# Altium schematic sheet 38.DRAM-LPDDR4X_200P_1X32bit.SchDoc (part 2 of 2)
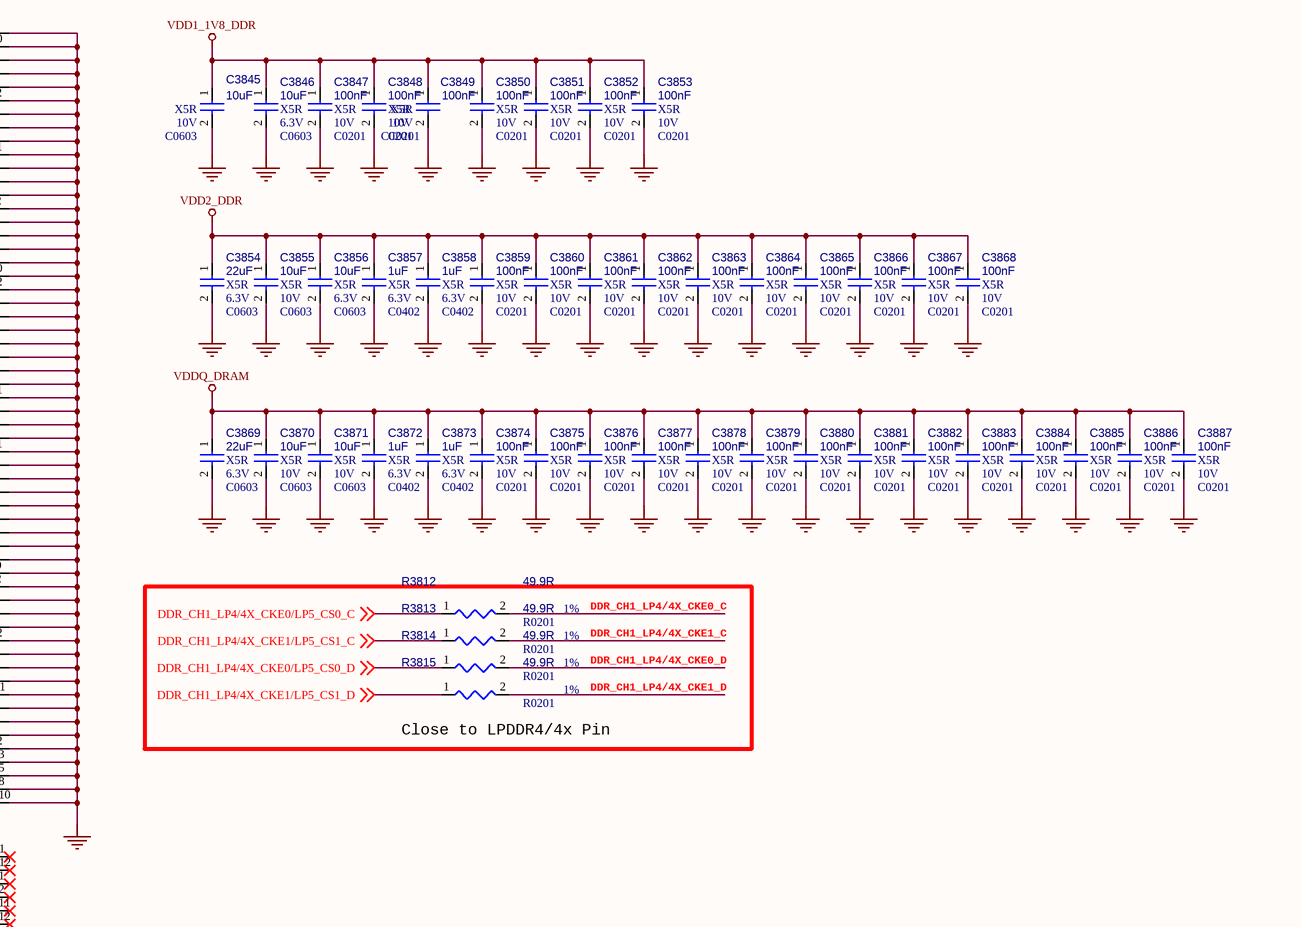
[diagram p4: 38.DRAM-LPDDR4X_200P_1X32bit.SchDoc, bottom right]

## Library data of the parts
C3800 = CAP NP: cap,10.00uF,+/-10%,10V,X5R,C0603; Part Reference: C3800; Manufacturer: TDK; Value: 10uF; Number: 37; RK PN: C1608X5R1A106K080AC; Priority: A; Tolerance: 10%; C_Voltage: 6.3V; PCB Footprint: C0603; Part Type: C0603; Manufacturer PN: C1608X5R1A106K080AC; Created by: JJJ
C3801 = CAP NP: cap,10.00uF,+/-10%,6.3V,X5R,C0603; Part Reference: C3801; Manufacturer: TDK; Value: 10uF; RK PN: C1608X5R0J106K080AB; Priority: A; Tolerance: 10%; PCB Footprint: C0603; Part Type: C0603; Manufacturer PN: C1608X5R0J106K080AB; Created by: JJJ
C3802 = CAP NP: cap,100.00nF,+/-10%,10V,X5R,C0201; Part Reference: C3802; Manufacturer PN: C0603X5R1A104K030BC; Manufacturer: TDK; Value: 100nF; Tolerance: 10%; Priority: A; PCB Footprint: C0201; Created by: JJJ; Part Type: C0201; RK PN: C0603X5R1A104K030BC
C3803 = CAP NP: cap,100.00nF,+/-10%,10V,X5R,C0201; Part Reference: C3803; Manufacturer: TDK; Value: 100nF; RK PN: C0603X5R1A104K030BC; Priority: A; Tolerance: 10%; PCB Footprint: C0201; Part Type: C0201; Manufacturer PN: C0603X5R1A104K030BC; Created by: JJJ
C3804 = CAP NP: cap,100.00nF,+/-10%,10V,X5R,C0201; Part Reference: C3804; Manufacturer PN: C0603X5R1A104K030BC; Manufacturer: TDK; Value: 100nF; C_Voltage: 6.3V; Tolerance: 10%; Priority: A; Number: 37; PCB Footprint: C0201; Created by: JJJ; Part Type: C0201; RK PN: C0603X5R1A104K030BC
C3805 = CAP NP: cap,100.00nF,+/-10%,10V,X5R,C0201; Part Reference: C3805; Manufacturer PN: C0603X5R1A104K030BC; Manufacturer: TDK; Value: 100nF; Tolerance: 10%; Priority: A; PCB Footprint: C0201; Created by: JJJ; Part Type: C0201; RK PN: C0603X5R1A104K030BC
C3806 = CAP NP: cap,100.00nF,+/-10%,10V,X5R,C0201; Part Reference: C3806; Manufacturer PN: C0603X5R1A104K030BC; Manufacturer: TDK; Value: 100nF; Tolerance: 10%; Priority: A; PCB Footprint: C0201; Created by: JJJ; Part Type: C0201; RK PN: C0603X5R1A104K030BC
C3807 = CAP NP: cap,100.00nF,+/-10%,10V,X5R,C0201; Part Reference: C3807; Manufacturer: TDK; Value: 100nF; RK PN: C0603X5R1A104K030BC; Priority: A; Tolerance: 10%; PCB Footprint: C0201; Part Type: C0201; Manufacturer PN: C0603X5R1A104K030BC; Created by: JJJ
C3808 = CAP NP: cap,100.00nF,+/-10%,10V,X5R,C0201; Part Reference: C3808; Manufacturer: TDK; Value: 100nF; RK PN: C0603X5R1A104K030BC; Priority: A; Tolerance: 10%; PCB Footprint: C0201; Part Type: C0201; Manufacturer PN: C0603X5R1A104K030BC; Created by: JJJ
C3809 = CAP NP: cap,22.00uF,+/-20%,6.3V,X5R,C0603; Part Reference: C3809; Manufacturer: TDK; Value: 22uF; RK PN: C1608X5R0J226M080AC; Priority: A; Tolerance: 20%; PCB Footprint: C0603; Part Type: C0603; C_Voltage: 6.3V; Manufacturer PN: C1608X5R0J226M080AC; Created by: JJJ
C3810 = CAP NP: cap,10.00uF,+/-10%,10V,X5R,C0603; Part Reference: C3810; Manufacturer: TDK; Value: 10uF; RK PN: C1608X5R1A106K080AC; Priority: A; C_Voltage: 6.3V; Tolerance: 10%; PCB Footprint: C0603; Part Type: C0603; Manufacturer PN: C1608X5R1A106K080AC; Created by: JJJ
C3811 = CAP NP: cap,10.00uF,+/-10%,6.3V,X5R,C0603; Part Reference: C3811; Manufacturer: TDK; Value: 10uF; RK PN: C1608X5R0J106K080AB; Priority: A; Tolerance: 10%; PCB Footprint: C0603; Part Type: C0603; Manufacturer PN: C1608X5R0J106K080AB; Created by: JJJ
C3812 = CAP NP: cap,1.00uF,+/-10%,6.3V,X5R,C0402; Part Reference: C3812; Manufacturer: TDK; Value: 1uF; RK PN: C1005X5R0J105K050BB; Priority: A; Tolerance: 10%; PCB Footprint: C0402; Part Type: C0402; Manufacturer PN: C1005X5R0J105K050BB; Created by: JJJ
C3813 = CAP NP: cap,1.00uF,+/-10%,6.3V,X5R,C0402; Part Reference: C3813; Manufacturer: TDK; Value: 1uF; RK PN: C1005X5R0J105K050BB; Priority: A; Tolerance: 10%; PCB Footprint: C0402; Part Type: C0402; Manufacturer PN: C1005X5R0J105K050BB; Created by: JJJ
C3814 = CAP NP: cap,100.00nF,+/-10%,10V,X5R,C0201; Part Reference: C3814; Manufacturer: TDK; Value: 100nF; RK PN: C0603X5R1A104K030BC; Priority: A; Tolerance: 10%; PCB Footprint: C0201; Part Type: C0201; Manufacturer PN: C0603X5R1A104K030BC; Created by: JJJ
C3815 = CAP NP: cap,100.00nF,+/-10%,10V,X5R,C0201; Part Reference: C3815; Manufacturer: TDK; Value: 100nF; RK PN: C0603X5R1A104K030BC; Priority: A; Tolerance: 10%; PCB Footprint: C0201; Part Type: C0201; Manufacturer PN: C0603X5R1A104K030BC; Created by: JJJ
C3816 = CAP NP: cap,100.00nF,+/-10%,10V,X5R,C0201; Part Reference: C3816; Manufacturer PN: C0603X5R1A104K030BC; Manufacturer: TDK; Value: 100nF; Tolerance: 10%; Priority: A; PCB Footprint: C0201; Created by: JJJ; Part Type: C0201; RK PN: C0603X5R1A104K030BC
C3817 = CAP NP: cap,100.00nF,+/-10%,10V,X5R,C0201; Part Reference: C3817; Manufacturer: TDK; Value: 100nF; RK PN: C0603X5R1A104K030BC; Priority: A; Tolerance: 10%; PCB Footprint: C0201; Part Type: C0201; Manufacturer PN: C0603X5R1A104K030BC; Created by: JJJ
C3818 = CAP NP: cap,100.00nF,+/-10%,10V,X5R,C0201; Part Reference: C3818; Manufacturer: TDK; Value: 100nF; RK PN: C0603X5R1A104K030BC; Priority: A; Tolerance: 10%; PCB Footprint: C0201; Part Type: C0201; Manufacturer PN: C0603X5R1A104K030BC; Created by: JJJ
C3819 = CAP NP: cap,100.00nF,+/-10%,10V,X5R,C0201; Part Reference: C3819; Manufacturer PN: C0603X5R1A104K030BC; Manufacturer: TDK; Value: 100nF; Tolerance: 10%; Priority: A; PCB Footprint: C0201; Created by: JJJ; Part Type: C0201; RK PN: C0603X5R1A104K030BC
C3820 = CAP NP: cap,100.00nF,+/-10%,10V,X5R,C0201; Part Reference: C3820; Manufacturer PN: C0603X5R1A104K030BC; Manufacturer: TDK; Value: 100nF; Tolerance: 10%; Priority: A; PCB Footprint: C0201; Created by: JJJ; Part Type: C0201; RK PN: C0603X5R1A104K030BC
C3821 = CAP NP: cap,100.00nF,+/-10%,10V,X5R,C0201; Part Reference: C3821; Manufacturer: TDK; Value: 100nF; RK PN: C0603X5R1A104K030BC; Priority: A; Tolerance: 10%; PCB Footprint: C0201; Part Type: C0201; Manufacturer PN: C0603X5R1A104K030BC; Created by: JJJ
C3822 = CAP NP: cap,100.00nF,+/-10%,10V,X5R,C0201; Part Reference: C3822; Manufacturer PN: C0603X5R1A104K030BC; Manufacturer: TDK; Value: 100nF; Tolerance: 10%; Priority: A; PCB Footprint: C0201; Created by: JJJ; Part Type: C0201; RK PN: C0603X5R1A104K030BC
C3823 = CAP NP: cap,100.00nF,+/-10%,10V,X5R,C0201; Part Reference: C3823; Manufacturer: TDK; Value: 100nF; RK PN: C0603X5R1A104K030BC; Priority: A; Tolerance: 10%; PCB Footprint: C0201; Part Type: C0201; Manufacturer PN: C0603X5R1A104K030BC; Created by: JJJ
C3824 = CAP NP: cap,22.00uF,+/-20%,6.3V,X5R,C0603; Part Reference: C3824; Manufacturer PN: C1608X5R0J226M080AC; Manufacturer: TDK; Value: 22uF; Tolerance: 20%; Priority: A; PCB Footprint: C0603; Created by: JJJ; C_Voltage: 6.3V; Part Type: C0603; RK PN: C1608X5R0J226M080AC
C3825 = CAP NP: cap,10.00uF,+/-10%,10V,X5R,C0603; Part Reference: C3825; Manufacturer: TDK; Value: 10uF; RK PN: C1608X5R1A106K080AC; Priority: A; C_Voltage: 6.3V; Tolerance: 10%; PCB Footprint: C0603; Part Type: C0603; Manufacturer PN: C1608X5R1A106K080AC; Created by: JJJ
C3826 = CAP NP: cap,10.00uF,+/-10%,10V,X5R,C0603; Part Reference: C3826; Manufacturer PN: C1608X5R1A106K080AC; Manufacturer: TDK; Value: 10uF; Tolerance: 10%; C_Voltage: 6.3V; Priority: A; PCB Footprint: C0603; Created by: JJJ; Part Type: C0603; RK PN: C1608X5R1A106K080AC
C3827 = CAP NP: cap,1.00uF,+/-10%,6.3V,X5R,C0402; Part Reference: C3827; Manufacturer PN: C1005X5R0J105K050BB; Manufacturer: TDK; Value: 1uF; Tolerance: 10%; Priority: A; PCB Footprint: C0402; Created by: JJJ; Part Type: C0402; RK PN: C1005X5R0J105K050BB
C3828 = CAP NP: cap,1.00uF,+/-10%,6.3V,X5R,C0402; Part Reference: C3828; Manufacturer PN: C1005X5R0J105K050BB; Manufacturer: TDK; Value: 1uF; Tolerance: 10%; Priority: A; PCB Footprint: C0402; Created by: JJJ; Part Type: C0402; RK PN: C1005X5R0J105K050BB
C3829 = CAP NP: cap,100.00nF,+/-10%,10V,X5R,C0201; Part Reference: C3829; Manufacturer PN: C0603X5R1A104K030BC; Manufacturer: TDK; Value: 100nF; Tolerance: 10%; Priority: A; PCB Footprint: C0201; Created by: JJJ; Part Type: C0201; RK PN: C0603X5R1A104K030BC
C3830 = CAP NP: cap,100.00nF,+/-10%,10V,X5R,C0201; Part Reference: C3830; Manufacturer PN: C0603X5R1A104K030BC; Manufacturer: TDK; Value: 100nF; Tolerance: 10%; Priority: A; PCB Footprint: C0201; Created by: JJJ; Part Type: C0201; RK PN: C0603X5R1A104K030BC
C3831 = CAP NP: cap,100.00nF,+/-10%,10V,X5R,C0201; Part Reference: C3831; Manufacturer PN: C0603X5R1A104K030BC; Manufacturer: TDK; Value: 100nF; Tolerance: 10%; Priority: A; PCB Footprint: C0201; Created by: JJJ; Part Type: C0201; RK PN: C0603X5R1A104K030BC
C3832 = CAP NP: cap,100.00nF,+/-10%,10V,X5R,C0201; Part Reference: C3832; Manufacturer: TDK; Value: 100nF; RK PN: C0603X5R1A104K030BC; Priority: A; Tolerance: 10%; PCB Footprint: C0201; Part Type: C0201; Manufacturer PN: C0603X5R1A104K030BC; Created by: JJJ
C3833 = CAP NP: cap,100.00nF,+/-10%,10V,X5R,C0201; Part Reference: C3833; Manufacturer: TDK; Value: 100nF; RK PN: C0603X5R1A104K030BC; Priority: A; Tolerance: 10%; PCB Footprint: C0201; Part Type: C0201; Manufacturer PN: C0603X5R1A104K030BC; Created by: JJJ
C3834 = CAP NP: cap,100.00nF,+/-10%,10V,X5R,C0201; Part Reference: C3834; Manufacturer: TDK; Value: 100nF; RK PN: C0603X5R1A104K030BC; Priority: A; Tolerance: 10%; PCB Footprint: C0201; Part Type: C0201; Manufacturer PN: C0603X5R1A104K030BC; Created by: JJJ
C3835 = CAP NP: cap,100.00nF,+/-10%,10V,X5R,C0201; Part Reference: C3835; Manufacturer PN: C0603X5R1A104K030BC; Manufacturer: TDK; Value: 100nF; Tolerance: 10%; Priority: A; PCB Footprint: C0201; Created by: JJJ; Part Type: C0201; RK PN: C0603X5R1A104K030BC
C3836 = CAP NP: cap,100.00nF,+/-10%,10V,X5R,C0201; Part Reference: C3836; Manufacturer: TDK; Value: 100nF; RK PN: C0603X5R1A104K030BC; Priority: A; Tolerance: 10%; PCB Footprint: C0201; Part Type: C0201; Manufacturer PN: C0603X5R1A104K030BC; Created by: JJJ
C3837 = CAP NP: cap,100.00nF,+/-10%,10V,X5R,C0201; Part Reference: C3837; Manufacturer: TDK; Value: 100nF; RK PN: C0603X5R1A104K030BC; Priority: A; Tolerance: 10%; PCB Footprint: C0201; Part Type: C0201; Manufacturer PN: C0603X5R1A104K030BC; Created by: JJJ
C3838 = CAP NP: cap,100.00nF,+/-10%,10V,X5R,C0201; Part Reference: C3838; Manufacturer PN: C0603X5R1A104K030BC; Manufacturer: TDK; Value: 100nF; Tolerance: 10%; Priority: A; PCB Footprint: C0201; Created by: JJJ; Part Type: C0201; RK PN: C0603X5R1A104K030BC
C3839 = CAP NP: cap,100.00nF,+/-10%,10V,X5R,C0201; Part Reference: C3839; Manufacturer: TDK; Value: 100nF; RK PN: C0603X5R1A104K030BC; Priority: A; Tolerance: 10%; PCB Footprint: C0201; Part Type: C0201; Manufacturer PN: C0603X5R1A104K030BC; Created by: JJJ
C3840 = CAP NP: cap,100.00nF,+/-10%,10V,X5R,C0201; Part Reference: C3840; Manufacturer PN: C0603X5R1A104K030BC; Manufacturer: TDK; Value: 100nF; Tolerance: 10%; Priority: A; PCB Footprint: C0201; Created by: JJJ; Part Type: C0201; RK PN: C0603X5R1A104K030BC
C3841 = CAP NP: cap,100.00nF,+/-10%,10V,X5R,C0201; Part Reference: C3841; Manufacturer PN: C0603X5R1A104K030BC; Manufacturer: TDK; Value: 100nF; Tolerance: 10%; Priority: A; PCB Footprint: C0201; Created by: JJJ; Part Type: C0201; RK PN: C0603X5R1A104K030BC
C3842 = CAP NP: cap,100.00nF,+/-10%,10V,X5R,C0201; Part Reference: C3842; Manufacturer PN: C0603X5R1A104K030BC; Manufacturer: TDK; Value: 100nF; Tolerance: 10%; Priority: A; PCB Footprint: C0201; Created by: JJJ; Part Type: C0201; RK PN: C0603X5R1A104K030BC
C3843 = CAP NP: cap,10.00uF,+/-10%,10V,X5R,C0603; Part Reference: C3843; Manufacturer PN: C1608X5R1A106K080AC; Manufacturer: TDK; Value: 10uF; C_Voltage: 6.3V; Tolerance: 10%; Priority: A; Number: 37; PCB Footprint: C0603; Created by: JJJ; Part Type: C0603; RK PN: C1608X5R1A106K080AC
C3844 = CAP NP: cap,1.00nF,+/-10%,25V,X5R,C0201; Part Reference: C3844; Manufacturer PN: C0603X5R1E102K030BA; Manufacturer: TDK; Value: 1nF; Tolerance: 10%; Priority: A; PCB Footprint: C0201; Created by: JJJ; Part Type: C0201; RK PN: C0603X5R1E102K030BA
C3845 = CAP NP: cap,10.00uF,+/-10%,10V,X5R,C0603; Part Reference: C3845; Manufacturer: TDK; Value: 10uF; Number: 37; RK PN: C1608X5R1A106K080AC; Priority: A; Tolerance: 10%; C_Voltage: 6.3V; PCB Footprint: C0603; Part Type: C0603; Manufacturer PN: C1608X5R1A106K080AC; Created by: JJJ
C3846 = CAP NP: cap,10.00uF,+/-10%,6.3V,X5R,C0603; Part Reference: C3846; Manufacturer: TDK; Value: 10uF; RK PN: C1608X5R0J106K080AB; Priority: A; Tolerance: 10%; PCB Footprint: C0603; Part Type: C0603; Manufacturer PN: C1608X5R0J106K080AB; Created by: JJJ
C3847 = CAP NP: cap,100.00nF,+/-10%,10V,X5R,C0201; Part Reference: C3847; Manufacturer PN: C0603X5R1A104K030BC; Manufacturer: TDK; Value: 100nF; Tolerance: 10%; Priority: A; PCB Footprint: C0201; Created by: JJJ; Part Type: C0201; RK PN: C0603X5R1A104K030BC
C3848 = CAP NP: cap,100.00nF,+/-10%,10V,X5R,C0201; Part Reference: C3848; Manufacturer: TDK; Value: 100nF; RK PN: C0603X5R1A104K030BC; Priority: A; Tolerance: 10%; PCB Footprint: C0201; Part Type: C0201; Manufacturer PN: C0603X5R1A104K030BC; Created by: JJJ
C3849 = CAP NP: cap,100.00nF,+/-10%,10V,X5R,C0201; Part Reference: C3849; Manufacturer PN: C0603X5R1A104K030BC; Manufacturer: TDK; Value: 100nF; C_Voltage: 6.3V; Tolerance: 10%; Priority: A; Number: 37; PCB Footprint: C0201; Created by: JJJ; Part Type: C0201; RK PN: C0603X5R1A104K030BC
C3850 = CAP NP: cap,100.00nF,+/-10%,10V,X5R,C0201; Part Reference: C3850; Manufacturer PN: C0603X5R1A104K030BC; Manufacturer: TDK; Value: 100nF; Tolerance: 10%; Priority: A; PCB Footprint: C0201; Created by: JJJ; Part Type: C0201; RK PN: C0603X5R1A104K030BC
C3851 = CAP NP: cap,100.00nF,+/-10%,10V,X5R,C0201; Part Reference: C3851; Manufacturer PN: C0603X5R1A104K030BC; Manufacturer: TDK; Value: 100nF; Tolerance: 10%; Priority: A; PCB Footprint: C0201; Created by: JJJ; Part Type: C0201; RK PN: C0603X5R1A104K030BC
C3852 = CAP NP: cap,100.00nF,+/-10%,10V,X5R,C0201; Part Reference: C3852; Manufacturer: TDK; Value: 100nF; RK PN: C0603X5R1A104K030BC; Priority: A; Tolerance: 10%; PCB Footprint: C0201; Part Type: C0201; Manufacturer PN: C0603X5R1A104K030BC; Created by: JJJ
C3853 = CAP NP: cap,100.00nF,+/-10%,10V,X5R,C0201; Part Reference: C3853; Manufacturer: TDK; Value: 100nF; RK PN: C0603X5R1A104K030BC; Priority: A; Tolerance: 10%; PCB Footprint: C0201; Part Type: C0201; Manufacturer PN: C0603X5R1A104K030BC; Created by: JJJ
C3854 = CAP NP: cap,22.00uF,+/-20%,6.3V,X5R,C0603; Part Reference: C3854; Manufacturer: TDK; Value: 22uF; RK PN: C1608X5R0J226M080AC; Priority: A; Tolerance: 20%; PCB Footprint: C0603; Part Type: C0603; C_Voltage: 6.3V; Manufacturer PN: C1608X5R0J226M080AC; Created by: JJJ
C3855 = CAP NP: cap,10.00uF,+/-10%,10V,X5R,C0603; Part Reference: C3855; Manufacturer: TDK; Value: 10uF; RK PN: C1608X5R1A106K080AC; Priority: A; C_Voltage: 6.3V; Tolerance: 10%; PCB Footprint: C0603; Part Type: C0603; Manufacturer PN: C1608X5R1A106K080AC; Created by: JJJ
C3856 = CAP NP: cap,10.00uF,+/-10%,6.3V,X5R,C0603; Part Reference: C3856; Manufacturer: TDK; Value: 10uF; RK PN: C1608X5R0J106K080AB; Priority: A; Tolerance: 10%; PCB Footprint: C0603; Part Type: C0603; Manufacturer PN: C1608X5R0J106K080AB; Created by: JJJ
C3857 = CAP NP: cap,1.00uF,+/-10%,6.3V,X5R,C0402; Part Reference: C3857; Manufacturer: TDK; Value: 1uF; RK PN: C1005X5R0J105K050BB; Priority: A; Tolerance: 10%; PCB Footprint: C0402; Part Type: C0402; Manufacturer PN: C1005X5R0J105K050BB; Created by: JJJ
C3858 = CAP NP: cap,1.00uF,+/-10%,6.3V,X5R,C0402; Part Reference: C3858; Manufacturer: TDK; Value: 1uF; RK PN: C1005X5R0J105K050BB; Priority: A; Tolerance: 10%; PCB Footprint: C0402; Part Type: C0402; Manufacturer PN: C1005X5R0J105K050BB; Created by: JJJ
C3859 = CAP NP: cap,100.00nF,+/-10%,10V,X5R,C0201; Part Reference: C3859; Manufacturer: TDK; Value: 100nF; RK PN: C0603X5R1A104K030BC; Priority: A; Tolerance: 10%; PCB Footprint: C0201; Part Type: C0201; Manufacturer PN: C0603X5R1A104K030BC; Created by: JJJ
C3860 = CAP NP: cap,100.00nF,+/-10%,10V,X5R,C0201; Part Reference: C3860; Manufacturer: TDK; Value: 100nF; RK PN: C0603X5R1A104K030BC; Priority: A; Tolerance: 10%; PCB Footprint: C0201; Part Type: C0201; Manufacturer PN: C0603X5R1A104K030BC; Created by: JJJ
C3861 = CAP NP: cap,100.00nF,+/-10%,10V,X5R,C0201; Part Reference: C3861; Manufacturer PN: C0603X5R1A104K030BC; Manufacturer: TDK; Value: 100nF; Tolerance: 10%; Priority: A; PCB Footprint: C0201; Created by: JJJ; Part Type: C0201; RK PN: C0603X5R1A104K030BC
C3862 = CAP NP: cap,100.00nF,+/-10%,10V,X5R,C0201; Part Reference: C3862; Manufacturer: TDK; Value: 100nF; RK PN: C0603X5R1A104K030BC; Priority: A; Tolerance: 10%; PCB Footprint: C0201; Part Type: C0201; Manufacturer PN: C0603X5R1A104K030BC; Created by: JJJ
C3863 = CAP NP: cap,100.00nF,+/-10%,10V,X5R,C0201; Part Reference: C3863; Manufacturer: TDK; Value: 100nF; RK PN: C0603X5R1A104K030BC; Priority: A; Tolerance: 10%; PCB Footprint: C0201; Part Type: C0201; Manufacturer PN: C0603X5R1A104K030BC; Created by: JJJ
C3864 = CAP NP: cap,100.00nF,+/-10%,10V,X5R,C0201; Part Reference: C3864; Manufacturer PN: C0603X5R1A104K030BC; Manufacturer: TDK; Value: 100nF; Tolerance: 10%; Priority: A; PCB Footprint: C0201; Created by: JJJ; Part Type: C0201; RK PN: C0603X5R1A104K030BC
C3865 = CAP NP: cap,100.00nF,+/-10%,10V,X5R,C0201; Part Reference: C3865; Manufacturer PN: C0603X5R1A104K030BC; Manufacturer: TDK; Value: 100nF; Tolerance: 10%; Priority: A; PCB Footprint: C0201; Created by: JJJ; Part Type: C0201; RK PN: C0603X5R1A104K030BC
C3866 = CAP NP: cap,100.00nF,+/-10%,10V,X5R,C0201; Part Reference: C3866; Manufacturer: TDK; Value: 100nF; RK PN: C0603X5R1A104K030BC; Priority: A; Tolerance: 10%; PCB Footprint: C0201; Part Type: C0201; Manufacturer PN: C0603X5R1A104K030BC; Created by: JJJ
C3867 = CAP NP: cap,100.00nF,+/-10%,10V,X5R,C0201; Part Reference: C3867; Manufacturer PN: C0603X5R1A104K030BC; Manufacturer: TDK; Value: 100nF; Tolerance: 10%; Priority: A; PCB Footprint: C0201; Created by: JJJ; Part Type: C0201; RK PN: C0603X5R1A104K030BC
C3868 = CAP NP: cap,100.00nF,+/-10%,10V,X5R,C0201; Part Reference: C3868; Manufacturer: TDK; Value: 100nF; RK PN: C0603X5R1A104K030BC; Priority: A; Tolerance: 10%; PCB Footprint: C0201; Part Type: C0201; Manufacturer PN: C0603X5R1A104K030BC; Created by: JJJ
C3869 = CAP NP: cap,22.00uF,+/-20%,6.3V,X5R,C0603; Part Reference: C3869; Manufacturer PN: C1608X5R0J226M080AC; Manufacturer: TDK; Value: 22uF; Tolerance: 20%; Priority: A; PCB Footprint: C0603; Created by: JJJ; C_Voltage: 6.3V; Part Type: C0603; RK PN: C1608X5R0J226M080AC
C3870 = CAP NP: cap,10.00uF,+/-10%,10V,X5R,C0603; Part Reference: C3870; Manufacturer: TDK; Value: 10uF; RK PN: C1608X5R1A106K080AC; Priority: A; C_Voltage: 6.3V; Tolerance: 10%; PCB Footprint: C0603; Part Type: C0603; Manufacturer PN: C1608X5R1A106K080AC; Created by: JJJ
C3871 = CAP NP: cap,10.00uF,+/-10%,10V,X5R,C0603; Part Reference: C3871; Manufacturer PN: C1608X5R1A106K080AC; Manufacturer: TDK; Value: 10uF; Tolerance: 10%; C_Voltage: 6.3V; Priority: A; PCB Footprint: C0603; Created by: JJJ; Part Type: C0603; RK PN: C1608X5R1A106K080AC
C3872 = CAP NP: cap,1.00uF,+/-10%,6.3V,X5R,C0402; Part Reference: C3872; Manufacturer PN: C1005X5R0J105K050BB; Manufacturer: TDK; Value: 1uF; Tolerance: 10%; Priority: A; PCB Footprint: C0402; Created by: JJJ; Part Type: C0402; RK PN: C1005X5R0J105K050BB
C3873 = CAP NP: cap,1.00uF,+/-10%,6.3V,X5R,C0402; Part Reference: C3873; Manufacturer PN: C1005X5R0J105K050BB; Manufacturer: TDK; Value: 1uF; Tolerance: 10%; Priority: A; PCB Footprint: C0402; Created by: JJJ; Part Type: C0402; RK PN: C1005X5R0J105K050BB
C3874 = CAP NP: cap,100.00nF,+/-10%,10V,X5R,C0201; Part Reference: C3874; Manufacturer PN: C0603X5R1A104K030BC; Manufacturer: TDK; Value: 100nF; Tolerance: 10%; Priority: A; PCB Footprint: C0201; Created by: JJJ; Part Type: C0201; RK PN: C0603X5R1A104K030BC
C3875 = CAP NP: cap,100.00nF,+/-10%,10V,X5R,C0201; Part Reference: C3875; Manufacturer PN: C0603X5R1A104K030BC; Manufacturer: TDK; Value: 100nF; Tolerance: 10%; Priority: A; PCB Footprint: C0201; Created by: JJJ; Part Type: C0201; RK PN: C0603X5R1A104K030BC
C3876 = CAP NP: cap,100.00nF,+/-10%,10V,X5R,C0201; Part Reference: C3876; Manufacturer PN: C0603X5R1A104K030BC; Manufacturer: TDK; Value: 100nF; Tolerance: 10%; Priority: A; PCB Footprint: C0201; Created by: JJJ; Part Type: C0201; RK PN: C0603X5R1A104K030BC
C3877 = CAP NP: cap,100.00nF,+/-10%,10V,X5R,C0201; Part Reference: C3877; Manufacturer: TDK; Value: 100nF; RK PN: C0603X5R1A104K030BC; Priority: A; Tolerance: 10%; PCB Footprint: C0201; Part Type: C0201; Manufacturer PN: C0603X5R1A104K030BC; Created by: JJJ
C3878 = CAP NP: cap,100.00nF,+/-10%,10V,X5R,C0201; Part Reference: C3878; Manufacturer: TDK; Value: 100nF; RK PN: C0603X5R1A104K030BC; Priority: A; Tolerance: 10%; PCB Footprint: C0201; Part Type: C0201; Manufacturer PN: C0603X5R1A104K030BC; Created by: JJJ
C3879 = CAP NP: cap,100.00nF,+/-10%,10V,X5R,C0201; Part Reference: C3879; Manufacturer: TDK; Value: 100nF; RK PN: C0603X5R1A104K030BC; Priority: A; Tolerance: 10%; PCB Footprint: C0201; Part Type: C0201; Manufacturer PN: C0603X5R1A104K030BC; Created by: JJJ
C3880 = CAP NP: cap,100.00nF,+/-10%,10V,X5R,C0201; Part Reference: C3880; Manufacturer PN: C0603X5R1A104K030BC; Manufacturer: TDK; Value: 100nF; Tolerance: 10%; Priority: A; PCB Footprint: C0201; Created by: JJJ; Part Type: C0201; RK PN: C0603X5R1A104K030BC
C3881 = CAP NP: cap,100.00nF,+/-10%,10V,X5R,C0201; Part Reference: C3881; Manufacturer: TDK; Value: 100nF; RK PN: C0603X5R1A104K030BC; Priority: A; Tolerance: 10%; PCB Footprint: C0201; Part Type: C0201; Manufacturer PN: C0603X5R1A104K030BC; Created by: JJJ
C3882 = CAP NP: cap,100.00nF,+/-10%,10V,X5R,C0201; Part Reference: C3882; Manufacturer: TDK; Value: 100nF; RK PN: C0603X5R1A104K030BC; Priority: A; Tolerance: 10%; PCB Footprint: C0201; Part Type: C0201; Manufacturer PN: C0603X5R1A104K030BC; Created by: JJJ
C3883 = CAP NP: cap,100.00nF,+/-10%,10V,X5R,C0201; Part Reference: C3883; Manufacturer PN: C0603X5R1A104K030BC; Manufacturer: TDK; Value: 100nF; Tolerance: 10%; Priority: A; PCB Footprint: C0201; Created by: JJJ; Part Type: C0201; RK PN: C0603X5R1A104K030BC
C3884 = CAP NP: cap,100.00nF,+/-10%,10V,X5R,C0201; Part Reference: C3884; Manufacturer: TDK; Value: 100nF; RK PN: C0603X5R1A104K030BC; Priority: A; Tolerance: 10%; PCB Footprint: C0201; Part Type: C0201; Manufacturer PN: C0603X5R1A104K030BC; Created by: JJJ
C3885 = CAP NP: cap,100.00nF,+/-10%,10V,X5R,C0201; Part Reference: C3885; Manufacturer PN: C0603X5R1A104K030BC; Manufacturer: TDK; Value: 100nF; Tolerance: 10%; Priority: A; PCB Footprint: C0201; Created by: JJJ; Part Type: C0201; RK PN: C0603X5R1A104K030BC
C3886 = CAP NP: cap,100.00nF,+/-10%,10V,X5R,C0201; Part Reference: C3886; Manufacturer PN: C0603X5R1A104K030BC; Manufacturer: TDK; Value: 100nF; Tolerance: 10%; Priority: A; PCB Footprint: C0201; Created by: JJJ; Part Type: C0201; RK PN: C0603X5R1A104K030BC
C3887 = CAP NP: cap,100.00nF,+/-10%,10V,X5R,C0201; Part Reference: C3887; Manufacturer PN: C0603X5R1A104K030BC; Manufacturer: TDK; Value: 100nF; Tolerance: 10%; Priority: A; PCB Footprint: C0201; Created by: JJJ; Part Type: C0201; RK PN: C0603X5R1A104K030BC
C3888 = CAP NP: cap,1.00nF,+/-10%,25V,X5R,C0201; Part Reference: C3888; Manufacturer PN: C0603X5R1E102K030BA; Manufacturer: TDK; Value: 1nF; Tolerance: 10%; Priority: A; PCB Footprint: C0201; Created by: JJJ; Part Type: C0201; RK PN: C0603X5R1E102K030BA
R3800 = RESISTOR_Dup1: НЁУГєсД¤µзЧи,0R,+/-5%,R0603,1/10W.; Part Reference: R3800; Manufacturer: YAGEO; RK PN: RC0603JR-070RL; Priority: A; Wattage: 1/10W; Value: 0R; Part Type: НЁУГєсД¤µзЧи; Manufacturer PN: RC0603JR-070RL; Created by: YTL
R3801 = RESISTOR_Dup1: НЁУГєсД¤µзЧи,49R9,+/-1%,R0201,1/20W.; Part Reference: R3801; Manufacturer: YAGEO; Value: 49.9R; RK PN: RC0201FR-0749R9L; Priority: A; Wattage: 1/20W; Part Type: НЁУГєсД¤µзЧи; Manufacturer PN: RC0201FR-0749R9L; Created by: YTL
R3802 = RESISTOR_Dup1: НЁУГєсД¤µзЧи,49R9,+/-1%,R0201,1/20W.; Part Reference: R3802; Manufacturer: YAGEO; Value: 49.9R; Wattage: 1/20W; RK PN: RC0201FR-0749R9L; Priority: A; Part Type: НЁУГєсД¤µзЧи; Manufacturer PN: RC0201FR-0749R9L; Created by: YTL
R3803 = RESISTOR_Dup1: НЁУГєсД¤µзЧи,0R,+/-5%,R0603,1/10W.; Part Reference: R3803; Manufacturer: YAGEO; RK PN: RC0603JR-070RL; Priority: A; Wattage: 1/10W; Value: 0R; Part Type: НЁУГєсД¤µзЧи; Manufacturer PN: RC0603JR-070RL; Created by: YTL
R3804 = RESISTOR_Dup1: НЁУГєсД¤µзЧи,49R9,+/-1%,R0201,1/20W.; Part Reference: R3804; Manufacturer PN: RC0201FR-0749R9L; Manufacturer: YAGEO; Value: 49.9R; Priority: A; Wattage: 1/20W; Created by: YTL; Part Type: НЁУГєсД¤µзЧи; RK PN: RC0201FR-0749R9L
R3805 = RESISTOR_Dup1: НЁУГєсД¤µзЧи,49R9,+/-1%,R0201,1/20W.; Part Reference: R3805; Manufacturer: YAGEO; Manufacturer PN: RC0201FR-0749R9L; Value: 49.9R; Wattage: 1/20W; Priority: A; Created by: YTL; Part Type: НЁУГєсД¤µзЧи; RK PN: RC0201FR-0749R9L
R3806 = RESISTOR_Dup1: НЁУГєсД¤µзЧи,10K,+/-5%,R0201,1/20W.; Part Reference: R3806; Manufacturer: YAGEO; RK PN: RC0201JR-0710KL; Priority: A; Wattage: 1/20W; Value: 10K; Part Type: НЁУГєсД¤µзЧи; Manufacturer PN: RC0201JR-0710KL; Created by: YTL
R3807 = RESISTOR_Dup1: НЁУГєсД¤µзЧи,10K,+/-5%,R0201,1/20W.; Part Reference: R3807; Manufacturer PN: RC0201JR-0710KL; Manufacturer: YAGEO; Wattage: 1/20W; Priority: A; Value: 10K; Created by: YTL; Part Type: НЁУГєсД¤µзЧи; RK PN: RC0201JR-0710KL
R3808 = RESISTOR_Dup1: НЁУГєсД¤µзЧи,0R,+/-5%,R0805,1/8W.; Part Reference: R3808; Manufacturer: YAGEO; RK PN: RC0805JR-070RL; Priority: A; Wattage: 1/8W; Value: 0R; Part Type: НЁУГєсД¤µзЧи; Manufacturer PN: RC0805JR-070RL; Created by: YTL
R3809 = RESISTOR_Dup1: НЁУГєсД¤µзЧи,240R,+/-1%,R0201,1/20W.; Part Reference: R3809; Manufacturer PN: RC0201FR-07240RL; Manufacturer: YAGEO; Wattage: 1/20W; Priority: A; Value: 240R; Created by: YTL; Part Type: НЁУГєсД¤µзЧи; RK PN: RC0201FR-07240RL
R3810 = RESISTOR_Dup1: НЁУГєсД¤µзЧи,240R,+/-1%,R0201,1/20W.; Part Reference: R3810; Manufacturer: YAGEO; RK PN: RC0201FR-07240RL; Priority: A; Wattage: 1/20W; Value: 240R; Part Type: НЁУГєсД¤µзЧи; Manufacturer PN: RC0201FR-07240RL; Created by: YTL
R3811 = RESISTOR_Dup1: НЁУГєсД¤µзЧи,0R,+/-5%,R0805,1/8W.; Part Reference: R3811; Manufacturer PN: RC0805JR-070RL; Manufacturer: YAGEO; Wattage: 1/8W; Priority: A; Value: 0R; Created by: YTL; Part Type: НЁУГєсД¤µзЧи; RK PN: RC0805JR-070RL
R3812 = RESISTOR_Dup1: НЁУГєсД¤µзЧи,49R9,+/-1%,R0201,1/20W.; Part Reference: R3812; Manufacturer: YAGEO; Value: 49.9R; Wattage: 1/20W; RK PN: RC0201FR-0749R9L; Priority: A; Part Type: НЁУГєсД¤µзЧи; Manufacturer PN: RC0201FR-0749R9L; Created by: YTL
R3813 = RESISTOR_Dup1: НЁУГєсД¤µзЧи,49R9,+/-1%,R0201,1/20W.; Part Reference: R3813; Manufacturer: YAGEO; Manufacturer PN: RC0201FR-0749R9L; Value: 49.9R; Wattage: 1/20W; Priority: A; Created by: YTL; Part Type: НЁУГєсД¤µзЧи; RK PN: RC0201FR-0749R9L
R3814 = RESISTOR_Dup1: НЁУГєсД¤µзЧи,49R9,+/-1%,R0201,1/20W.; Part Reference: R3814; Manufacturer: YAGEO; Manufacturer PN: RC0201FR-0749R9L; Value: 49.9R; Wattage: 1/20W; Priority: A; Created by: YTL; Part Type: НЁУГєсД¤µзЧи; RK PN: RC0201FR-0749R9L
R3815 = RESISTOR_Dup1: НЁУГєсД¤µзЧи,49R9,+/-1%,R0201,1/20W.; Part Reference: R3815; Manufacturer: YAGEO; Value: 49.9R; Wattage: 1/20W; RK PN: RC0201FR-0749R9L; Priority: A; Part Type: НЁУГєсД¤µзЧи; Manufacturer PN: RC0201FR-0749R9L; Created by: YTL
R3816 = RESISTOR_Dup1: НЁУГєсД¤µзЧи,10K,+/-5%,R0201,1/20W.; Part Reference: R3816; Manufacturer PN: RC0201JR-0710KL; Manufacturer: YAGEO; Wattage: 1/20W; Priority: A; Value: 10K; Created by: YTL; Part Type: НЁУГєсД¤µзЧи; RK PN: RC0201JR-0710KL
R3817 = RESISTOR_Dup1: НЁУГєсД¤µзЧи,10K,+/-5%,R0201,1/20W.; Part Reference: R3817; Manufacturer: YAGEO; RK PN: RC0201JR-0710KL; Priority: A; Wattage: 1/20W; Value: 10K; Part Type: НЁУГєсД¤µзЧи; Manufacturer PN: RC0201JR-0710KL; Created by: YTL
R3818 = RESISTOR_Dup1: НЁУГєсД¤µзЧи,240R,+/-1%,R0201,1/20W.; Part Reference: R3818; Manufacturer PN: RC0201FR-07240RL; Manufacturer: YAGEO; Wattage: 1/20W; Priority: A; Value: 240R; Created by: YTL; Part Type: НЁУГєсД¤µзЧи; RK PN: RC0201FR-07240RL
R3819 = RESISTOR_Dup1: НЁУГєсД¤µзЧи,240R,+/-1%,R0201,1/20W.; Part Reference: R3819; Manufacturer PN: RC0201FR-07240RL; Manufacturer: YAGEO; Wattage: 1/20W; Priority: A; Value: 240R; Created by: YTL; Part Type: НЁУГєсД¤µзЧи; RK PN: RC0201FR-07240RL
U3800 = LPDDR4_200P: Part Reference: U3800; PCB Footprint: BGA200_15R00X10R00X0R90; Value: LPDDR4_200P
U3801 = LPDDR4_200P: Part Reference: U3801; PCB Footprint: BGA200_15R00X10R00X0R90; Value: LPDDR4_200P